# Altium project egse.PrjPcb (part 3 of 5)

## Sheet 4_mcu.SchDoc: Microcontroller
size A4; OrganizationName: Pluton UPV; Address1: Universitat Politècnica; Address2: de València (UPV); Address3: Camí de Vera, València; Address4: Spain; SheetNumber: 5; SheetTotal: 12
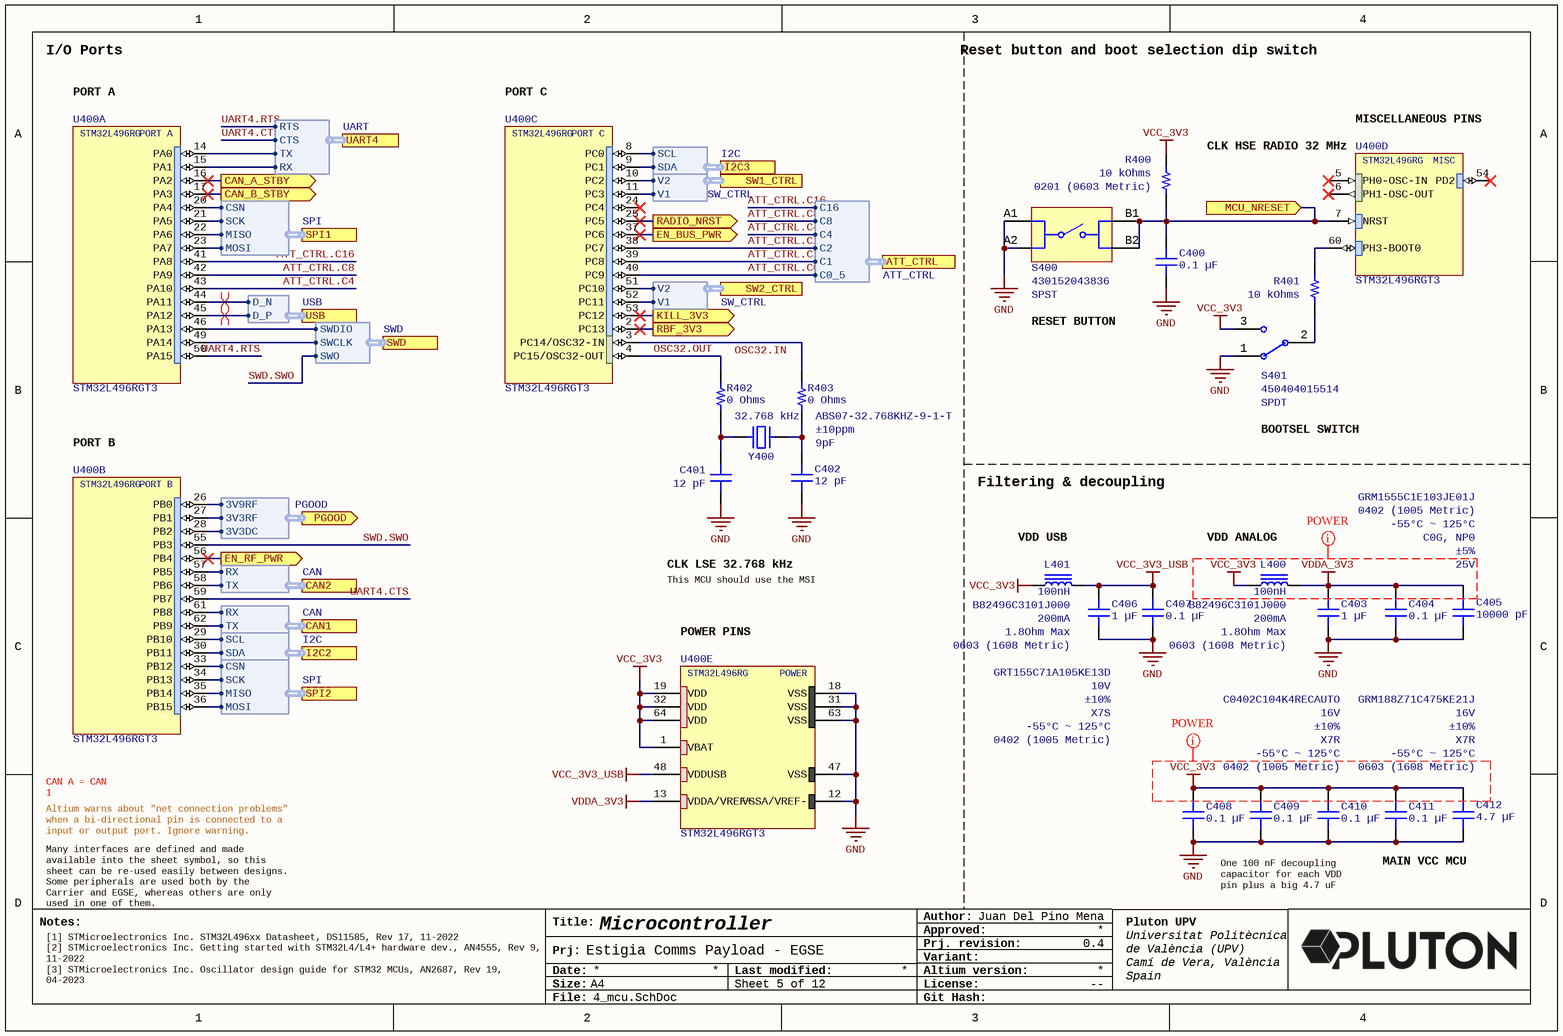
[diagram p4: 4_mcu.SchDoc]

### Parts
C400  0.1 µF  [CAP 0402_1005]
C401  12 pF  [CAP 0201_0603]
C402  12 pF  [CAP 0201_0603]
C403  1 µF  [CAP 0402_1005]
C404  0.1 µF  [CAP 0402_1005]
C405  Part Number: GRM1555C1E103JE01J  Device Package: 0402 (1005 Metric)  Operating Temperature: -55°C ~ 125°C  Temperature Coefficient: C0G, NP0  Tolerance: ±5%  Voltage - Rated: 25V  [CAP 0402_1005]  (hidden comment: 10000 pF)
C406  Part Number: GRT155C71A105KE13D  Device Package: 0402 (1005 Metric)  Operating Temperature: -55°C ~ 125°C  Temperature Coefficient: X7S  Tolerance: ±10%  Voltage - Rated: 10V  [CAP 0402_1005]  (hidden comment: 1 µF)
C407  0.1 µF  [CAP 0402_1005]
C408  0.1 µF  [CAP 0402_1005]
C409  Part Number: C0402C104K4RECAUTO  Operating Temperature: -55°C ~ 125°C  Package / Case: 0402 (1005 Metric)  Temperature Coefficient: X7R  Tolerance: ±10%  Voltage - Rated: 16V  [CAP 0402_1005]  (hidden comment: 0.1 µF)
C410  0.1 µF  [CAP 0402_1005]
C411  0.1 µF  [CAP 0402_1005]
C412  Part Number: GRM188Z71C475KE21J  Device Package: 0603 (1608 Metric)  Operating Temperature: -55°C ~ 125°C  Temperature Coefficient: X7R  Tolerance: ±10%  Voltage - Rated: 16V  [CAP 0603_1608]  (hidden comment: 4.7 µF)
L400  100nH  Part Number: B82496C3101J000  Current Rating (Amps): 200mA  DC Resistance (DCR): 1.8Ohm Max  Device Package: 0603 (1608 Metric)  [IND 0603_1608 RF WW]
L401  100nH  Part Number: B82496C3101J000  Current Rating (Amps): 200mA  DC Resistance (DCR): 1.8Ohm Max  Device Package: 0603 (1608 Metric)  [IND 0603_1608 RF WW]
R400  Package / Case: 0201 (0603 Metric)  [RES 0201_0603]  (hidden comment: 10 kOhms)
R401  10 kOhms  [RES 0201_0603]
R402  0 Ohms  [RES 0201_0603]
R403  0 Ohms  [RES 0201_0603]
S400  430152043836  Throw Configuration: SPST  [WS-TASV_L6W6H4.3_4301x20438x6]
S401  Circuit: SPDT  [WURTH WS-SLSU 450404015514]  (hidden comment: 450404015514)
U400  STM32L496RGT3  [LQFP64]  (parts A,B,C,D,E of 5)
Y400  Part Number: ABS07-32.768KHZ-9-1-T  Frequency Tolerance: ±10ppm  Load Capacitance: 9pF  [ABRACON ABS07]  (hidden comment: 32.768 kHz)

### Ports
ATT_CTRL (harness ATT_CTRL, see 1_cover[3B], 5_1_attenuators[4B], 5_rf_path[2C]), CAN1 (harness CAN, see 1_cover[3A]), CAN2 (harness CAN, see 1_cover[3B]), CAN_A_STBY (out, see 1_cover[3A], 2_cubesat_bus[3A]), CAN_B_STBY (out, see 1_cover[3B], 2_cubesat_bus[3B]), EN_BUS_PWR (out, see 1_cover[3C], 7_power_prot_mon[1C]), EN_RF_PWR (out, see 1_cover[3B], 6_power_dcdc[1B]), I2C2 (harness I2C, see 1_cover[3B]), I2C3 (harness I2C, see 1_cover[3C]), KILL_3V3 (out, see 1_cover[3B], 2_cubesat_bus[4C]), MCU_NRESET (in, see 1_cover[3C], 3_ports[3A]), PGOOD (out, harness PGOOD, see 1_cover[3B], 6_power_dcdc[4A]), RADIO_NRST (out, see 1_cover[3B], 5_4_transceiver[1B], 5_rf_path[1B]), RBF_3V3 (out, see 1_cover[3B], 2_cubesat_bus[4C]), SPI1 (harness SPI, see 1_cover[3B]), SPI2 (harness SPI, see 1_cover[3B]), SW1_CTRL (harness SW_CTRL, see 1_cover[3B], 5_rf_path[1A]), SW2_CTRL (harness SW_CTRL, see 1_cover[3B], 5_rf_path[1A]), SWD (harness SWD, see 1_cover[3C], 3_ports[3A]), UART4 (harness UART, see 1_cover[3C]), USB (harness USB, see 1_cover[3C], 3_ports[3C])

### Harnesses
SPI: CSN, SCK, MISO, MOSI
CAN: RX, TX
I2C: SCL, SDA
SWD: SWDIO, SWCLK, SWO
USB: D_N, D_P
UART: TX, RX, CTS, RTS
PGOOD: 3V3DC, 3V3RF, 3V9RF
ATT_CTRL: C16, C8, C4, C2, C1, C0_5
SW_CTRL: V1, V2

### Nets
GND: C400.1 C401.1 C402.1 C403.1 C404.1 C405.1 C406.1 C407.1 C408.1 C409.1 C410.1 C411.1 C412.1 S400.A1 S400.A2 S401.1 U400.12(VSSA/VREF-) U400.18(VSS) U400.31(VSS) U400.47(VSS) U400.63(VSS)
VCC_3V3: C408.2 C409.2 C410.2 C411.2 C412.2 L400.1 L401.1 R400.2 S401.3 U400.1(VBAT) U400.19(VDD) U400.32(VDD) U400.64(VDD)
VCC_3V3_USB: C406.2 C407.2 L401.2 U400.48(VDDUSB)
VDDA_3V3: C403.2 C404.2 C405.2 L400.2 U400.13(VDDA/VREF+)
ATT_CTRL.C0_5: U400.40(PC9) ; port ATT_CTRL.C0_5
ATT_CTRL.C1: U400.39(PC8) ; port ATT_CTRL.C1
ATT_CTRL.C2: U400.38(PC7) ; port ATT_CTRL.C2
ATT_CTRL.C4: U400.43(PA10) ; port ATT_CTRL.C4
ATT_CTRL.C8: U400.42(PA9) ; port ATT_CTRL.C8
ATT_CTRL.C16: U400.41(PA8) ; port ATT_CTRL.C16
CAN_A_STBY: U400.16(PA2) ; port CAN_A_STBY
CAN_B_STBY: U400.17(PA3) ; port CAN_B_STBY
EN_BUS_PWR: U400.37(PC6) ; port EN_BUS_PWR
EN_RF_PWR: U400.56(PB4) ; port EN_RF_PWR
KILL_3V3: U400.53(PC12) ; port KILL_3V3
MCU_NRESET: C400.2 R400.1 S400.B1 S400.B2 U400.7(NRST) ; port MCU_NRESET
OSC32.IN: R403.2 U400.3(PC14/OSC32-IN)  [project net OSC32.IN_5]
OSC32.OUT: R402.2 U400.4(PC15/OSC32-OUT)  [project net OSC32.OUT_5]
PGOOD.3V3DC: U400.28(PB2) ; port PGOOD.3V3DC
PGOOD.3V3RF: U400.27(PB1) ; port PGOOD.3V3RF
PGOOD.3V9RF: U400.26(PB0) ; port PGOOD.3V9RF
RADIO_NRST: U400.25(PC5) ; port RADIO_NRST
RBF_3V3: U400.2(PC13) ; port RBF_3V3
SWD.SWO: U400.55(PB3) ; port SWD.SWO
UART4.CTS: U400.59(PB7) ; port UART4.CTS
UART4.RTS: U400.50(PA15) ; port UART4.RTS
NetC401_2: C401.2 R402.1 Y400.1
NetC402_2: C402.2 R403.1 Y400.2
NetC548_2: U400.20(PA4) ; port SPI1.CSN
NetR401_1: R401.1 S401.2(COM)
NetR401_2: R401.2 U400.60(PH3-BOOT0)
NetR500_1: U400.11(PC3) ; port SW1_CTRL.V1
NetR500_2: U400.10(PC2) ; port SW1_CTRL.V2
NetR500_3: U400.52(PC11) ; port SW2_CTRL.V1
NetR500_4: U400.51(PC10) ; port SW2_CTRL.V2
NetR700_1: U400.8(PC0) ; port I2C3.SCL
NetR701_1: U400.9(PC1) ; port I2C3.SDA
NetR800_7: U400.49(PA14) ; port SWD.SWCLK
NetR800_8: U400.46(PA13) ; port SWD.SWDIO
NetR801_7: U400.14(PA0) ; port UART4.TX
NetR801_8: U400.15(PA1) ; port UART4.RX
NetU200_1: U400.62(PB9) ; port CAN1.TX
NetU200_4: U400.61(PB8) ; port CAN1.RX
NetU201_1: U400.58(PB6) ; port CAN2.TX
NetU201_4: U400.57(PB5) ; port CAN2.RX
NetU400_21: U400.21(PA5) ; port SPI1.SCK
NetU400_22: U400.22(PA6) ; port SPI1.MISO
NetU400_23: U400.23(PA7) ; port SPI1.MOSI
NetU400_29: U400.29(PB10) ; port I2C2.SCL
NetU400_30: U400.30(PB11) ; port I2C2.SDA
NetU400_33: U400.33(PB12) ; port SPI2.CSN
NetU400_34: U400.34(PB13) ; port SPI2.SCK
NetU400_35: U400.35(PB14) ; port SPI2.MISO
NetU400_36: U400.36(PB15) ; port SPI2.MOSI
NetU400_44: U400.44(PA11) ; port USB.D_N
NetU400_45: U400.45(PA12) ; port USB.D_P

Not connected (* = marked no-connect by the designer): U400 5(PH0-OSC-IN)* 6(PH1-OSC-OUT)* 24(PC4)* 54(PD2)*

### Layout directives
differential pair: NetU400_44, NetU400_45
rule Width Constraint [Pref Width = 0.4mm    Min Width = 0.3mm    Max Width = 0.5mm]; net class POWER: VCC_3V3, VDDA_3V3

### Notes on the sheet
- I/O Ports
- PORT A
- PORT C
- Reset button and boot selection dip switch
- CLK HSE RADIO 32 MHz
- MISCELLANEOUS PINS
- RESET BUTTON
- PORT B
- BOOTSEL SWITCH
- Filtering & decoupling
- CLK LSE 32.768 kHz
- This MCU should use the MSI clock
- (near L401) VDD USB
- (near L400) VDD ANALOG
- POWER PINS
- CAN A = CAN 1
  CAN B = CAN 2
- Altium warns about "net connection problems" when a bi-directional pin is connected to a input or output port. Ignore warning.
- Many interfaces are defined and made available into the sheet symbol, so this sheet can be re-used easily between designs. Some peripherals are used both by the Carrier and EGSE, whereas others are only used in one of them.
- One 100 nF decoupling capacitor for each VDD pin plus a big 4.7 uF cap [2]
- MAIN VCC MCU
- [1] STMicroelectronics Inc. STM32L496xx Datasheet, DS11585, Rev 17, 11-2022
  [2] STMicroelectronics Inc. Getting started with STM32L4/L4+ hardware dev., AN4555, Rev 9, 11-2022
  [3] STMicroelectronics Inc. Oscillator design guide for STM32 MCUs, AN2687, Rev 19, 04-2023
- Notes:
- Title:
- Author:
- Approved:
- Date:
- Prj:
- Size:
- A4
- Last modified:
- Altium version:
- Variant:
- Prj. revision:
- License:
- --
- File:
- Git Hash:
- (in symbol STM32L496RGT3, part A) STM32L496RG; PORT A
- (in symbol STM32L496RGT3, part B) STM32L496RG; PORT B
- (in symbol STM32L496RGT3, part C) STM32L496RG; PORT C
- (in symbol STM32L496RGT3, part D) STM32L496RG; MISC
- (in symbol STM32L496RGT3, part E) STM32L496RG; POWER

### Library data of the parts
C400 C404 C407-C411 = C0402C104K4RECAUTO: CAP CER 0402 0.1UF 16V X7R 10%; manufacturer: KEMET; Value: 0.1 µF; Applications: Automotive, ESD Protection; Capacitance: 0.1 µF; componentlink1description: Datasheet; componentlink1url: https://api.kemet.com/component-edge/download/datasheet/C0402C104K4RECAUTO.pdf; componentlink2description: DigiKey Link; componentlink2url: https://www.digikey.com/en/products/detail/kemet/C0402C104K4RECAUTO/8563695; Device Package: 0402 (1005 Metric); lastupdated: 09/02/2024 20:04:38; Lifecycle Status: Active; Minimum Order: 1; Mounting Type: Surface Mount, MLCC; packaging: TapeAndReel; partid: 1731; Part Status: Active; price: 0.01; Ratings: AEC-Q200; series: ESD SMD Auto X7R; Size / Dimension: 0.039" L x 0.020" W (1.00mm x 0.50mm); Supplier 1: DigiKey; Supplier Part Number 1: 399-17167-1-ND; Thickness (Max): 0.022" (0.55mm)
  C400 C404 C407 C408 C410 C411: Part Number: C0402C104K4RECAUTO; Operating Temperature: -55°C ~ 125°C; Package / Case: 0402 (1005 Metric); Temperature Coefficient: X7R; Tolerance: ±10%; Voltage - Rated: 16V
C401 C402 = CBR02C120F3GAC: CAP CER 12PF 25V C0G/NP0 0201; manufacturer: KEMET; Temperature Coefficient: C0G, NP0; Tolerance: ±1%; Part Number: CBR02C120F3GAC; Value: 12 pF; Applications: RF, Microwave, High Frequency; Capacitance: 12 pF; componentlink1description: Datasheet; componentlink1url: https://api.kemet.com/component-edge/download/datasheet/CBR02C120F3GAC.pdf; componentlink2description: DigiKey Link; componentlink2url: https://www.digikey.com/en/products/detail/kemet/CBR02C120F3GAC/3479199; Device Package: 0201 (0603 Metric); Features: High Q, Low Loss, Ultra Low ESR; lastupdated: 04/06/2024 19:01:11; Lifecycle Status: Active; Minimum Order: 1; Mounting Type: Surface Mount, MLCC; Operating Temperature: -55°C ~ 125°C; Package / Case: 0201 (0603 Metric); packaging: TapeAndReel; partid: 143; Part Status: Active; price: 0.07; series: CBR-SMD RF C0G; Size / Dimension: 0.024" L x 0.012" W (0.60mm x 0.30mm); Supplier 1: DigiKey; Supplier Part Number 1: 399-8604-1-ND; Thickness (Max): 0.013" (0.33mm); Voltage - Rated: 25V
C403 = GRT155C71A105KE13D: CAP CER 1UF 10V X7S 0402; manufacturer: Murata Electronics; Tolerance: ±10%; Part Number: GRT155C71A105KE13D; Value: 1 µF; Applications: Automotive; Capacitance: 1 µF; componentlink1description: Datasheet; componentlink1url: https://search.murata.co.jp/Ceramy/image/img/A01X/G101/ENG/GRT155C71A105KE13-01.pdf; componentlink2description: DigiKey Link; componentlink2url: https://www.digikey.com/en/products/detail/murata-electronics/GRT155C71A105KE13D/10695747; Device Package: 0402 (1005 Metric); lastupdated: 09/02/2024 20:04:05; Lifecycle Status: Active; Minimum Order: 1; Mounting Type: Surface Mount, MLCC; Operating Temperature: -55°C ~ 125°C; Package / Case: 0402 (1005 Metric); packaging: TapeAndReel; partid: 47127; Part Status: Active; price: 0.04; Ratings: AEC-Q200; series: GRT; Size / Dimension: 0.039" L x 0.020" W (1.00mm x 0.50mm); Supplier 1: DigiKey; Supplier Part Number 1: 490-GRT155C71A105KE13DCT-ND; Temperature Coefficient: X7S; Thickness (Max): 0.024" (0.60mm); Voltage - Rated: 10V
C405 = GRM1555C1E103JE01J: CAP CER 10000PF 25V C0G/NP0 0402; manufacturer: Murata Electronics; Value: 10000 pF; Applications: General Purpose; Capacitance: 10000 pF; componentlink1description: Datasheet; componentlink1url: https://search.murata.co.jp/Ceramy/image/img/A01X/G101/ENG/GRM1555C1E103JE01-01A.pdf; componentlink2description: DigiKey Link; componentlink2url: https://www.digikey.com/en/products/detail/murata-electronics/GRM1555C1E103JE01J/16033801; lastupdated: 09/02/2024 20:04:09; Lifecycle Status: Active; Minimum Order: 1; Mounting Type: Surface Mount, MLCC; Package / Case: 0402 (1005 Metric); packaging: TapeAndReel; partid: 41084; Part Status: Active; price: 0.02; series: GRM; Size / Dimension: 0.039" L x 0.020" W (1.00mm x 0.50mm); Supplier 1: DigiKey; Supplier Part Number 1: 490-GRM1555C1E103JE01JCT-ND; Thickness (Max): 0.026" (0.65mm)
C406 = GRT155C71A105KE13D: as C204 on sheet 2_cubesat_bus; Value: 1 µF; Applications: Automotive; Capacitance: 1 µF; componentlink1description: Datasheet; componentlink1url: https://search.murata.co.jp/Ceramy/image/img/A01X/G101/ENG/GRT155C71A105KE13-01.pdf; componentlink2description: DigiKey Link; componentlink2url: https://www.digikey.com/en/products/detail/murata-electronics/GRT155C71A105KE13D/10695747; lastupdated: 09/02/2024 20:04:05; Lifecycle Status: Active; Minimum Order: 1; Mounting Type: Surface Mount, MLCC; Package / Case: 0402 (1005 Metric); packaging: TapeAndReel; partid: 47127; Part Status: Active; price: 0.04; Ratings: AEC-Q200; series: GRT; Size / Dimension: 0.039" L x 0.020" W (1.00mm x 0.50mm); Supplier 1: DigiKey; Supplier Part Number 1: 490-GRT155C71A105KE13DCT-ND; Thickness (Max): 0.024" (0.60mm)
C412 = GRM188Z71C475KE21J: CAP CER 4.7UF 16V X7R 0603; manufacturer: Murata Electronics; Value: 4.7 µF; Applications: General Purpose; Capacitance: 4.7 µF; componentlink1description: Datasheet; componentlink1url: https://search.murata.co.jp/Ceramy/image/img/A01X/G101/ENG/GRM188Z71C475KE21-01A.pdf; componentlink2description: DigiKey Link; componentlink2url: https://www.digikey.com/en/products/detail/murata-electronics/GRM188Z71C475KE21J/16033436; lastupdated: 09/02/2024 20:09:51; Lifecycle Status: Active; Minimum Order: 1; Mounting Type: Surface Mount, MLCC; Package / Case: 0603 (1608 Metric); packaging: TapeAndReel; partid: 41988; Part Status: Active; price: 0.04; series: GRM; Size / Dimension: 0.063" L x 0.031" W (1.60mm x 0.80mm); Supplier 1: DigiKey; Supplier Part Number 1: 490-GRM188Z71C475KE21JCT-ND; Thickness (Max): 0.039" (1.00mm)
L400 L401 = B82496C3101J000: FIXED IND 100NH 200MA 1.8 OHM; Manufacturer: TDK Electronics Inc.; Frequency - Self Resonant: 1.8GHz; Inductance Frequency - Test: 100MHz; Material - Core: Ceramic; Q @ Freq: 14 @ 100MHz; Shielding: Unshielded; Tolerance: ±5%; Type: Wirewound; ComponentLink1Description: Datasheet; ComponentLink1URL: https://www.tdk-electronics.tdk.com/inf/30/db/ind_2008/b82496c.pdf; ComponentLink2Description: DigiKey Link; ComponentLink2URL: http://digikey.com/product-detail/en/tdk-electronics-inc/B82496C3101J000/495-1825-1-ND/697680; Inductance: 100nH; LastUpdated: 06/09/2020 11:05:16; Lifecycle Status: Active; Minimum Order: 1; Mounting Type: Surface Mount; Operating Temperature: -55°C ~ 150°C; Package / Case: 0603 (1608 Metric); Packaging: TapeAndReel; PartId: 755; Part Status: Active; Price: 0.16; Ratings: AEC-Q200; Series: SIMID; Supplier 1: DigiKey; Supplier Part Number 1: 495-1825-1-ND; Supplier Device Package: 0603 (1608 Metric); Value: 100nH
R400 R401 = AF0201FR-0710KL: RES SMD 10K OHM 1% 1/20W 0201; Manufacturer: Yageo; Power (Watts): 0.05W, 1/20W; Temperature Coefficient: ±200ppm/°C; Part Number: AF0201FR-0710KL; Value: 10 kOhms; ComponentLink1Description: Datasheet; ComponentLink1URL: https://www.yageo.com/upload/media/product/productsearch/datasheet/rchip/PYu-AF_51_RoHS_L_9.pdf; ComponentLink2Description: DigiKey Link; ComponentLink2URL: https://www.digikey.com/en/products/detail/yageo/AF0201FR-0710KL/5900138; Composition: Thick Film; Device Package: 0201 (0603 Metric); Features: Anti-Sulfur, Automotive AEC-Q200; Height - Seated (Max): 0.010" (0.26mm); LastUpdated: 04/06/2024 19:11:47; Lifecycle Status: Active; Minimum Order: 1; Number of Terminations: 2; Operating Temperature: -55°C ~ 125°C; Packaging: TapeAndReel; PartId: 78061; Part Status: Active; Price: 0.01; Ratings: AEC-Q200; Resistance: 10 kOhms; Series: AF; Size / Dimension: 0.024" L x 0.012" W (0.60mm x 0.30mm); Supplier 1: DigiKey; Supplier Part Number 1: 13-AF0201FR-0710KLCT-ND; Supplier Device Package: 0201; Tolerance: ±1%
  R401: Package / Case: 0201 (0603 Metric)
R402 R403 = AC0201JR-070RL: RES SMD 0 OHM JUMPER 1/20W 0201; Manufacturer: Yageo; Power (Watts): 0.05W, 1/20W; Part Number: AC0201JR-070RL; Value: 0 Ohms; ComponentLink1Description: Datasheet; ComponentLink1URL: https://www.yageo.com/upload/media/product/productsearch/datasheet/rchip/PYu-AC_51_RoHS_L_7.pdf; ComponentLink2Description: DigiKey Link; ComponentLink2URL: https://www.digikey.com/en/products/detail/yageo/AC0201JR-070RL/5894880; Composition: Thick Film; Device Package: 0201 (0603 Metric); Features: Automotive AEC-Q200, Moisture Resistant; Height - Seated (Max): 0.010" (0.26mm); LastUpdated: 04/06/2024 19:12:00; Lifecycle Status: Active; Minimum Order: 1; Number of Terminations: 2; Operating Temperature: -55°C ~ 155°C; Package / Case: 0201 (0603 Metric); Packaging: CutTape; PartId: 818; Part Status: Active; Price: 0.01; Ratings: AEC-Q200; Resistance: 0 Ohms; Series: AC; Size / Dimension: 0.024" L x 0.012" W (0.60mm x 0.30mm); Supplier 1: DigiKey; Supplier Part Number 1: YAG3427CT-ND; Supplier Device Package: 0201; Tolerance: Jumper
S400 = CMP-1452-00002-2: NexarPartId: 22861785; Voltage Rating: 12V; Current Rating: 50mA; Switch Travel: 250µm; Switch Function: Off-Mom; Actuator Material: Liquid Crystal Polymer, Polymer; Insulation Resistance: 100MΩ; Actuator Length: 900µm; Mechanical Life: 200kcycles; Illumination Type: Illuminated, Non-Illuminated; Mount: Surface Mount; Max Operating Temperature: 85°C; Height: 4.3mm; RoHS: Compliant; Length: 6.2mm; Color: Orange; Width: 6.2mm; Contact Current Rating: 50mA; Diameter: 3.5mm; Termination: Gull Wing; Packaging: Tape and Reel; REACH SVHC: No SVHC; Contact Plating: Silver; Min Operating Temperature: -40°C; Contact Material: Stainless Steel, Steel
S401 = 450404015514: MINI SLIDE SWITCH 6.7 X 2.7 MM.; Manufacturer: Würth Elektronik; Rated Current: 300mA; Rated Voltage: 5VDC; Switching Function: On-On; Actuator Length: 1.50mm; Actuator Type: Standard; Contact Timing: Non-Shorting (BBM); Current Rating (Amps): 300mA (DC); Voltage Rating - DC: 5 V; ComponentLink1Description: Datasheet; ComponentLink1URL: https://katalog.we-online.de/em/datasheet/450404015514.pdf; ComponentLink2Description: DigiKey Link; ComponentLink2URL: https://www.digikey.com/en/products/detail/würth-elektronik/450404015514/9950812; Packaging: TapeAndReel; Publisher: Wurth Elektronik; Contact Material: Copper Alloy; Mounting Technology: SMT; Operating Temperature: -40°C ~ 85°C; Contact Plating: Silver; Part Number: 450404015514; Published Date: September 2019; Terminal Material: Copper Alloy; Size: 6.7x2.7mm; Terminal Plating: Silver; Contact Finish: Silver; LastUpdated: 20/06/2022 13:21:56; Lifecycle Status: Active; Minimum Order: 1; Mounting Type: Surface Mount; PartId: 5; Part Status: Active; Price: 0.48; Series: WS-SLSU; Supplier 1: DigiKey; Supplier Part Number 1: 732-13665-1-ND; Switch Function: On-On; Termination Style: SMD (SMT) Tab
U400 = STM32L496RGT3: Ultra-low-power Arm® Cortex®-M4 32-bit MCU+FPU, 100 DMIPS, up to 1 MB flash, 320 KB SRAM, USB OTG FS, audio, LQFP64
Y400 = ABS07-32.768KHZ-9-1-T: CRYSTAL 32.7680KHZ 9PF SMD; Manufacturer: Abracon LLC; ESR (Equivalent Series Resistance): 70 kOhms; Operating Mode: Fundamental; ComponentLink1Description: Datasheet; ComponentLink1URL: https://abracon.com/Resonators/ABS07.pdf; ComponentLink2Description: DigiKey Link; ComponentLink2URL: https://www.digikey.com/en/products/detail/abracon-llc/ABS07-32-768KHZ-9-1-T/5980075; Frequency: 32.768 kHz; Height - Seated (Max): 0.035" (0.90mm); LastUpdated: 03/06/2024 20:02:04; Lifecycle Status: Active; Minimum Order: 1; Mounting Type: Surface Mount; Operating Temperature: -40°C ~ 85°C; Package / Case: 2-SMD, No Lead; Packaging: TapeAndReel; PartId: 380; Part Status: Active; Price: 0.86; Series: ABS07; Size / Dimension: 0.126" L x 0.059" W (3.20mm x 1.50mm); Supplier 1: DigiKey; Supplier Part Number 1: 535-13479-1-ND; Type: kHz Crystal (Tuning Fork); Value: 32.768 kHz

## Sheet 5_rf_path.SchDoc: RF path and LoRa transceiver
size A4; OrganizationName: Pluton UPV; Address1: Universitat Politècnica; Address2: de València (UPV); Address3: Camí de Vera, València; Address4: Spain; SheetNumber: 6; SheetTotal: 12
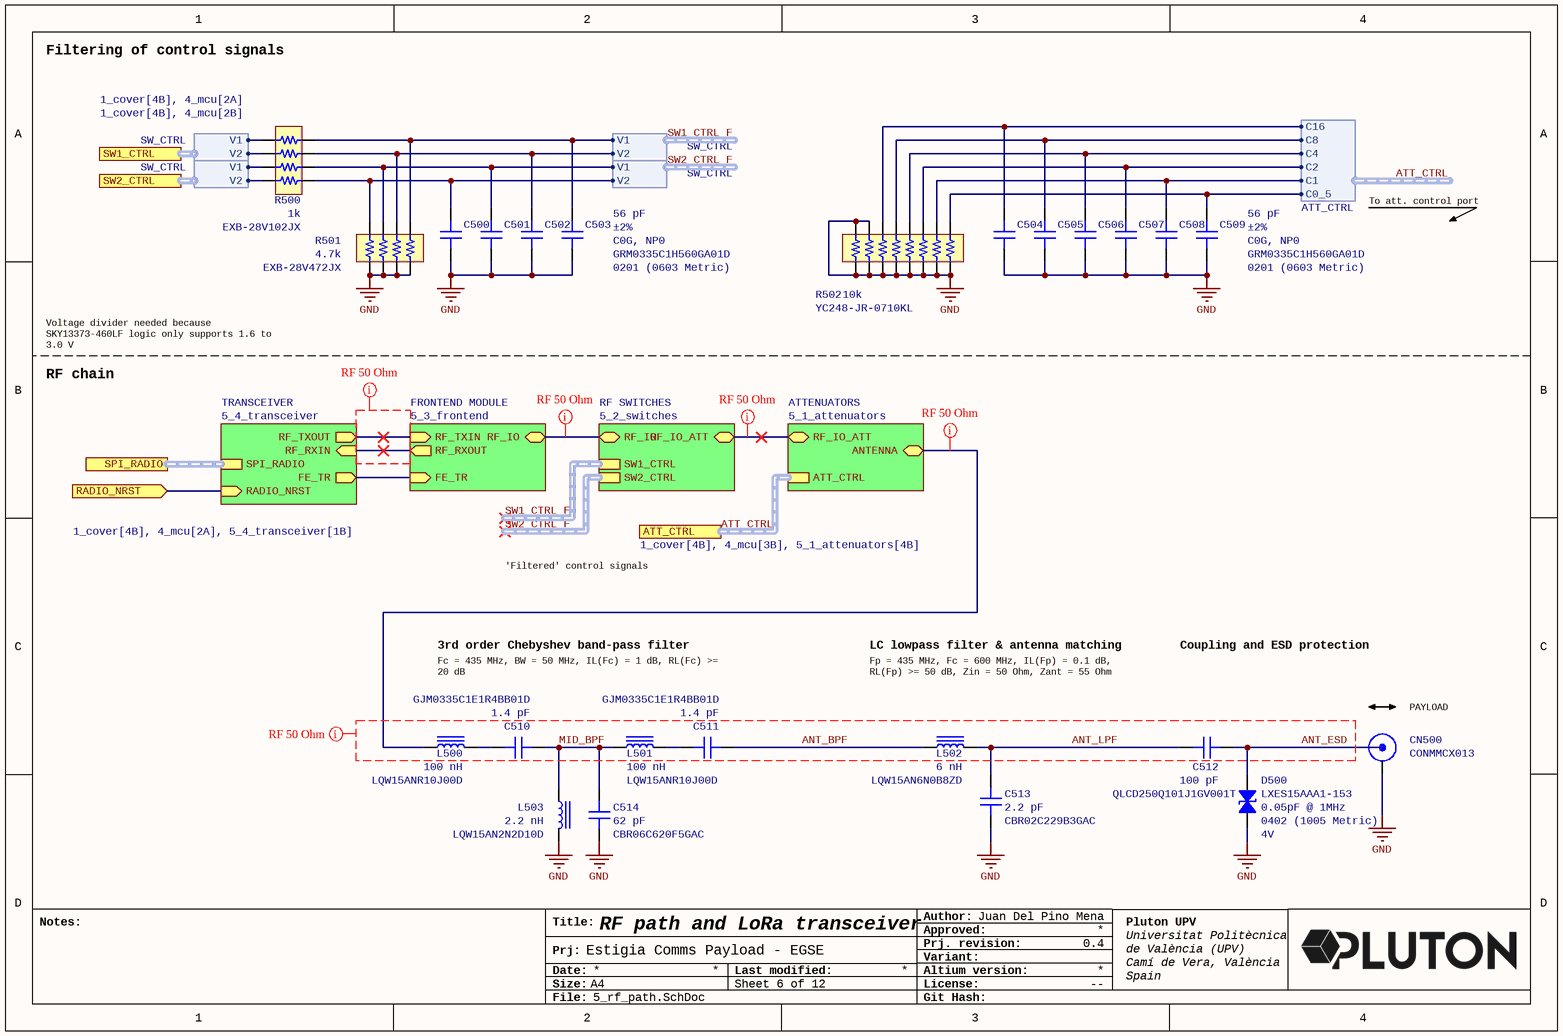
[diagram p5: 5_rf_path.SchDoc]

### Parts
C500  56 pF  [CAP 0201_0603]  (value not drawn)
C501  56 pF  [CAP 0201_0603]  (value not drawn)
C502  56 pF  [CAP 0201_0603]  (value not drawn)
C503  Part Number: GRM0335C1H560GA01D  Package / Case: 0201 (0603 Metric)  Temperature Coefficient: C0G, NP0  Tolerance: ±2%  [CAP 0201_0603]  (hidden comment: 56 pF)
C504  56 pF  [CAP 0201_0603]  (value not drawn)
C505  56 pF  [CAP 0201_0603]  (value not drawn)
C506  56 pF  [CAP 0201_0603]  (value not drawn)
C507  56 pF  [CAP 0201_0603]  (value not drawn)
C508  56 pF  [CAP 0201_0603]  (value not drawn)
C509  Part Number: GRM0335C1H560GA01D  Package / Case: 0201 (0603 Metric)  Temperature Coefficient: C0G, NP0  Tolerance: ±2%  [CAP 0201_0603]  (hidden comment: 56 pF)
C510  Part Number: GJM0335C1E1R4BB01D  [CAP 0201_0603 RF]  (hidden comment: 1.4 pF)
C511  Part Number: GJM0335C1E1R4BB01D  [CAP 0201_0603 RF]  (hidden comment: 1.4 pF)
C512  Part Number: QLCD250Q101J1GV001T  [CAP 0201_0603 RF]  (hidden comment: 100 pF)
C513  Part Number: CBR02C229B3GAC  [CAP 0201_0603 RF]  (hidden comment: 2.2 pF)
C514  Part Number: CBR06C620F5GAC  [CAP 0603_1608 RF]  (hidden comment: 62 pF)
CN500  CONMMCX013  [CONMMCX013]
D500  Capacitance @ Frequency: 0.05pF @ 1MHz  Device Package: 0402 (1005 Metric)  Voltage - Reverse Standoff (Typ): 4V  [0402]  (hidden comment: LXES15AAA1-153)
L500  Part Number: LQW15ANR10J00D  [IND 0402_1005 RF WW]  (hidden comment: 100 nH)
L501  Part Number: LQW15ANR10J00D  [IND 0402_1005 RF WW]  (hidden comment: 100 nH)
L502  Part Number: LQW15AN6N0B8ZD  [IND 0402_1005 RF WW]  (hidden comment: 6 nH)
L503  Part Number: LQW15AN2N2D10D  [IND 0402_1005 RF WW]  (hidden comment: 2.2 nH)
R500  Resistance (Ohms): 1k  [RESNET 0804-8 CONVEX]  (hidden comment: EXB-28V102JX)
R501  Resistance (Ohms): 4.7k  [RESNET 0804-8 CONVEX]  (hidden comment: EXB-28V472JX)
R502  Resistance (Ohms): 10k  [RESNET 1606-16 CONVEX]  (hidden comment: YC248-JR-0710KL)

### Sub-sheets
ATTENUATORS = 5_1_attenuators: RF_IO_ATT (bidir), ANTENNA (bidir), ATT_CTRL (harness ATT_CTRL)
FRONTEND MODULE = 5_3_frontend: RF_TXIN (in), RF_RXOUT (out), RF_IO (bidir), FE_TR (in)
RF SWITCHES = 5_2_switches: RF_IO_ATT (bidir), RF_IO (bidir), SW1_CTRL (harness SW_CTRL), SW2_CTRL (harness SW_CTRL)
TRANSCEIVER = 5_4_transceiver: RF_TXOUT (out), RF_RXIN (in), FE_TR (out), SPI_RADIO (harness SPI), RADIO_NRST (in)

### Ports
ATT_CTRL (harness ATT_CTRL, see 1_cover[4B], 4_mcu[3B], 5_1_attenuators[4B]), RADIO_NRST (in, see 1_cover[4B], 4_mcu[2A], 5_4_transceiver[1B]), SPI_RADIO (harness SPI, see 1_cover[4B], 5_4_transceiver[1B]), SW1_CTRL (harness SW_CTRL, see 1_cover[4B], 4_mcu[2A]), SW2_CTRL (harness SW_CTRL, see 1_cover[4B], 4_mcu[2B])

### Harnesses
SW_CTRL: V1, V2
ATT_CTRL: C16, C8, C4, C2, C1, C0_5

### Nets
GND: C500.1 C501.1 C502.1 C503.1 C504.1 C505.1 C506.1 C507.1 C508.1 C509.1 C513.1 C514.1 CN500.2(GND) D500.1 L503.2 R501.5 R501.6 R501.7 R501.8 R502.1 R502.2 R502.3 R502.4 R502.5 R502.6 R502.7 R502.8 R502.15 R502.16
ANT_BPF: C511.2 L502.1  [project net ANT_BPF_6]
ANT_ESD: C512.2 CN500.1(SIGNAL) D500.2  [project net ANT_ESD_6]
ANT_LPF: C512.1 C513.2 L502.2  [project net ANT_LPF_6]
ANTENNA: L500.1 ; sheet ATTENUATORS/ANTENNA
ATT_CTRL.C0_5: C509.2 R502.9 ; port ATT_CTRL.C0_5
ATT_CTRL.C1: C508.2 R502.10 ; port ATT_CTRL.C1
ATT_CTRL.C2: C507.2 R502.11 ; port ATT_CTRL.C2
ATT_CTRL.C4: C506.2 R502.12 ; port ATT_CTRL.C4
ATT_CTRL.C8: C505.2 R502.13 ; port ATT_CTRL.C8
ATT_CTRL.C16: C504.2 R502.14 ; port ATT_CTRL.C16
FE_TR: sheet FRONTEND MODULE/FE_TR, sheet TRANSCEIVER/FE_TR
MID_BPF: C510.2 C514.2 L501.1 L503.1  [project net MID_BPF_6]
RADIO_NRST: port RADIO_NRST, sheet TRANSCEIVER/RADIO_NRST
RF_IO: sheet RF SWITCHES/RF_IO, sheet FRONTEND MODULE/RF_IO
RF_IO_ATT: sheet RF SWITCHES/RF_IO_ATT, sheet ATTENUATORS/RF_IO_ATT
RF_RXIN: sheet FRONTEND MODULE/RF_RXOUT, sheet TRANSCEIVER/RF_RXIN
RF_TXIN: sheet FRONTEND MODULE/RF_TXIN, sheet TRANSCEIVER/RF_TXOUT
SW1_CTRL_F.V1: C503.2 R500.8 R501.1 ; sheet RF SWITCHES/SW1_CTRL.V1
SW1_CTRL_F.V2: C502.2 R500.7 R501.2 ; sheet RF SWITCHES/SW1_CTRL.V2
SW2_CTRL_F.V1: C501.2 R500.6 R501.3 ; sheet RF SWITCHES/SW2_CTRL.V1
SW2_CTRL_F.V2: C500.2 R500.5 R501.4 ; sheet RF SWITCHES/SW2_CTRL.V2
NetC510_1: C510.1 L500.2
NetC511_1: C511.1 L501.2
NetR500_1: R500.1 ; port SW1_CTRL.V1
NetR500_2: R500.2 ; port SW1_CTRL.V2
NetR500_3: R500.3 ; port SW2_CTRL.V1
NetR500_4: R500.4 ; port SW2_CTRL.V2

### Buses and harness runs
harness ATT_CTRL = port ATT_CTRL = sheet ATTENUATORS/ATT_CTRL
harness port SPI_RADIO = sheet TRANSCEIVER/SPI_RADIO
harness SW1_CTRL_F = sheet RF SWITCHES/SW1_CTRL
harness SW2_CTRL_F = sheet RF SWITCHES/SW2_CTRL

### Layout directives
net class RF50; rule Width Constraint [Pref Impedance = 50.00ohms    Min Impedance = 50.00ohms    Max Impedance = 50.00ohms]: (no net found under the mark), ANT_BPF, ANT_ESD, ANT_LPF, ANTENNA, MID_BPF, RF_IO, RF_IO_ATT

### Notes on the sheet
- Filtering of control signals
- To att. control port
- Voltage divider needed because SKY13373-460LF logic only supports 1.6 to 3.0 V
- RF chain
- 'Filtered' control signals
- 3rd order Chebyshev band-pass filter
- LC lowpass filter & antenna matching
- Coupling and ESD protection
- Fc = 435 MHz, BW = 50 MHz, IL(Fc) = 1 dB, RL(Fc) >= 20 dB
  Za = Zb = 50 Ohm
- Fp = 435 MHz, Fc = 600 MHz, IL(Fp) = 0.1 dB,
  RL(Fp) >= 50 dB, Zin = 50 Ohm, Zant = 55 Ohm
- (near CN500) PAYLOAD
- Notes:
- Title:
- Author:
- Approved:
- Date:
- Prj:
- Size:
- A4
- Last modified:
- Altium version:
- Variant:
- Prj. revision:
- License:
- --
- File:
- Git Hash:

### Library data of the parts
C500-C502 C504-C508 = GRM0335C1H560GA01D: CAP CER 56PF 50V C0G/NP0 0201; manufacturer: Murata Electronics; Temperature Coefficient: C0G, NP0; Tolerance: ±2%; Part Number: GRM0335C1H560GA01D; Value: 56 pF; Applications: General Purpose; Capacitance: 56 pF; componentlink1description: Datasheet; componentlink1url: https://search.murata.co.jp/Ceramy/image/img/A01X/G101/ENG/GRM0335C1H560GA01-01.pdf; componentlink2description: DigiKey Link; componentlink2url: https://www.digikey.com/en/products/detail/murata-electronics/GRM0335C1H560GA01D/4358755; Device Package: 0201 (0603 Metric); lastupdated: 04/06/2024 19:01:09; Lifecycle Status: Active; Minimum Order: 1; Mounting Type: Surface Mount; Operating Temperature: -55°C ~ 125°C; Package / Case: 0201 (0603 Metric); packaging: CutTape; partid: 528; Part Status: Active; price: 0.01; series: GRM; Size / Dimension: 0.024" L x 0.012" W (0.60mm x 0.30mm); Supplier 1: DigiKey; Supplier Part Number 1: 490-13329-1-ND; Thickness (Max): 0.013" (0.33mm); Voltage - Rated: 50V
C503 C509 = GRM0335C1H560GA01D: CAP CER 56PF 50V C0G/NP0 0201; manufacturer: Murata Electronics; Value: 56 pF; Applications: General Purpose; Capacitance: 56 pF; componentlink1description: Datasheet; componentlink1url: https://search.murata.co.jp/Ceramy/image/img/A01X/G101/ENG/GRM0335C1H560GA01-01.pdf; componentlink2description: DigiKey Link; componentlink2url: https://www.digikey.com/en/products/detail/murata-electronics/GRM0335C1H560GA01D/4358755; Device Package: 0201 (0603 Metric); lastupdated: 04/06/2024 19:01:09; Lifecycle Status: Active; Minimum Order: 1; Mounting Type: Surface Mount; Operating Temperature: -55°C ~ 125°C; packaging: CutTape; partid: 528; Part Status: Active; price: 0.01; series: GRM; Size / Dimension: 0.024" L x 0.012" W (0.60mm x 0.30mm); Supplier 1: DigiKey; Supplier Part Number 1: 490-13329-1-ND; Thickness (Max): 0.013" (0.33mm); Voltage - Rated: 50V
C510 C511 = GJM0335C1E1R4BB01D: CAP CER 1.4PF 25V C0G/NP0 0201; manufacturer: Murata Electronics; Temperature Coefficient: C0G, NP0; Tolerance: ±0.1pF; Applications: RF, Microwave, High Frequency; Capacitance: 1.4 pF; componentlink1description: Datasheet; componentlink1url: https://search.murata.co.jp/Ceramy/image/img/A01X/G101/ENG/GJM0335C1E1R4BB01-01.pdf; componentlink2description: DigiKey Link; componentlink2url: https://www.digikey.com/en/products/detail/murata-electronics/GJM0335C1E1R4BB01D/2592522; Device Package: 0201 (0603 Metric); Features: High Q, Low Loss; lastupdated: 03/06/2024 19:34:09; Lifecycle Status: Active; Minimum Order: 1; Mounting Type: Surface Mount; Operating Temperature: -55°C ~ 125°C; Package / Case: 0201 (0603 Metric); packaging: TapeAndReel; partid: 255; Part Status: Active; price: 0.01; series: GJM; Size / Dimension: 0.024" L x 0.012" W (0.60mm x 0.30mm); Supplier 1: DigiKey; Supplier Part Number 1: 490-11174-1-ND; Thickness (Max): 0.013" (0.33mm); value: 1.4 pF; Voltage - Rated: 25V
C512 = QLCD250Q101J1GV001T: CAP CER 100PF 25V C0G/NP0 0201; manufacturer: Johanson Technology Inc.; Temperature Coefficient: C0G, NP0; Tolerance: ±5%; Applications: RF, Microwave, High Frequency; Capacitance: 100 pF; componentlink1description: Datasheet; componentlink1url: https://www.johansontechnology.com/downloads/catalog/johanson-technology-multi-layer-high-q-capacitors.pdf; componentlink2description: DigiKey Link; componentlink2url: https://www.digikey.com/en/products/detail/johanson-technology-inc/QLCD250Q101J1GV001T/1561511; Device Package: 0201 (0603 Metric); Features: High Q, Low Loss; lastupdated: 03/06/2024 19:34:07; Lifecycle Status: Active; Minimum Order: 1; Mounting Type: Surface Mount, MLCC; Operating Temperature: -55°C ~ 125°C; Package / Case: 0201 (0603 Metric); packaging: TapeAndReel; partid: 3724; Part Status: Active; price: 0.02; series: L; Size / Dimension: 0.024" L x 0.012" W (0.60mm x 0.30mm); Supplier 1: DigiKey; Supplier Part Number 1: 712-QLCD250Q101J1GV001TCT-ND; Thickness (Max): 0.013" (0.33mm); value: 100 pF; Voltage - Rated: 25V
C513 = CBR02C229B3GAC: CAP CER 2.2PF 25V C0G/NP0 0201; manufacturer: KEMET; Temperature Coefficient: C0G, NP0; Tolerance: ±0.1pF; Applications: RF, Microwave, High Frequency; Capacitance: 2.2 pF; componentlink1description: Datasheet; componentlink1url: https://api.kemet.com/component-edge/download/datasheet/CBR02C229B3GAC.pdf; componentlink2description: DigiKey Link; componentlink2url: https://www.digikey.com/en/products/detail/kemet/CBR02C229B3GAC/3479233; Device Package: 0201 (0603 Metric); Features: High Q, Low Loss, Ultra Low ESR; lastupdated: 03/06/2024 19:34:10; Lifecycle Status: Active; Minimum Order: 1; Mounting Type: Surface Mount, MLCC; Operating Temperature: -55°C ~ 125°C; Package / Case: 0201 (0603 Metric); packaging: TapeAndReel; partid: 161; Part Status: Active; price: 0.02; series: CBR-SMD RF C0G; Size / Dimension: 0.024" L x 0.012" W (0.60mm x 0.30mm); Supplier 1: DigiKey; Supplier Part Number 1: 399-8607-1-ND; Thickness (Max): 0.013" (0.33mm); value: 2.2 pF; Voltage - Rated: 25V
C514 = CBR06C620F5GAC: CAP CER 62PF 50V C0G/NP0 0603; manufacturer: KEMET; Temperature Coefficient: C0G, NP0; Tolerance: ±1%; Applications: RF, Microwave, High Frequency; Capacitance: 62 pF; componentlink1description: Datasheet; componentlink1url: https://api.kemet.com/component-edge/download/datasheet/CBR06C620F5GAC.pdf; componentlink2description: DigiKey Link; componentlink2url: https://www.digikey.com/en/products/detail/kemet/CBR06C620F5GAC/7649525; Device Package: 0603 (1608 Metric); Features: High Q, Low Loss, Ultra Low ESR; lastupdated: 03/06/2024 19:44:09; Lifecycle Status: Active; Minimum Order: 1; Mounting Type: Surface Mount, MLCC; Operating Temperature: -55°C ~ 125°C; Package / Case: 0603 (1608 Metric); packaging: TapeAndReel; partid: 3653; Part Status: Active; price: 0.30; series: CBR-SMD RF C0G; Size / Dimension: 0.063" L x 0.031" W (1.60mm x 0.80mm); Supplier 1: DigiKey; Supplier Part Number 1: 399-16219-1-ND; Thickness (Max): 0.035" (0.90mm); value: 62 pF; Voltage - Rated: 50V
CN500 = MMCX-CONMMCX013: MMCX Jack PCB Cutout Edge Mount Connector 0 to 8.5 GHz operation MMCX (female socket) connection
D500 = LXES15AAA1-153: TVS DIODE 4V 1005; Manufacturer: Murata Electronics; Bidirectional Channels: 1; Power Line Protection: No; Type: Zener; Part Number: LXES15AAA1-153; Applications: General Purpose; ComponentLink1Description: Datasheet; ComponentLink1URL: https://www.murata.com/en-us/products/productdata/8796832759838/CRESD-E.pdf; ComponentLink2Description: DigiKey Link; ComponentLink2URL: http://digikey.com/product-detail/en/murata-electronics/LXES15AAA1-153/490-13210-2-ND/5843762; LastUpdated: 03/06/2024 20:23:00; Lifecycle Status: Active; Minimum Order: 0; Mounting Type: Surface Mount; Operating Temperature: -40°C ~ 85°C (TA); Package / Case: 0402 (1005 Metric); Packaging: TapeAndReel; PartId: 10448; Part Status: Active; Price: 0.04; Series: -; Supplier 1: DigiKey; Supplier Part Number 1: 490-13210-2-ND; Supplier Device Package: 1005
L500 L501 = LQW15ANR10J00D: FIXED IND 100NH 120MA 2.52OHM SM; Manufacturer: Murata Electronics; DC Resistance (DCR): 2.52Ohm Max; Frequency - Self Resonant: 1.5GHz; Inductance Frequency - Test: 100 MHz; Material - Core: Non-Magnetic; Q @ Freq: 20 @ 150MHz; Shielding: Unshielded; Tolerance: ±5%; Type: Drum Core, Wirewound; ComponentLink1Description: Datasheet; ComponentLink1URL: https://search.murata.co.jp/Ceramy/image/img/P02/JELF243A-0050.pdf; ComponentLink2Description: DigiKey Link; ComponentLink2URL: https://www.digikey.com/en/products/detail/murata-electronics/LQW15ANR10J00D/1016249; Current Rating (Amps): 120 mA; Device Package: 0402 (1005 Metric); Height - Seated (Max): 0.024" (0.60mm); Inductance: 100 nH; LastUpdated: 03/06/2024 20:03:22; Lifecycle Status: Active; Minimum Order: 1; Mounting Type: Surface Mount; Operating Temperature: -55°C ~ 125°C; Package / Case: 0402 (1005 Metric); Packaging: TapeAndReel; PartId: 282; Part Status: Active; Price: 0.04; Series: LQW15; Size / Dimension: 0.039" L x 0.020" W (1.00mm x 0.50mm); Supplier 1: DigiKey; Supplier Part Number 1: 490-4090-1-ND; Value: 100 nH
L502 = LQW15AN6N0B8ZD: FIXED IND 6NH 1.6A 0.056OHM SMD; Manufacturer: Murata Electronics; DC Resistance (DCR): 56mOhm Max; Frequency - Self Resonant: 8GHz; Inductance Frequency - Test: 100 MHz; Material - Core: Non-Magnetic; Q @ Freq: 32 @ 250MHz; Shielding: Unshielded; Tolerance: ±0.1nH; Type: Drum Core, Wirewound; ComponentLink1Description: Datasheet; ComponentLink1URL: https://search.murata.co.jp/Ceramy/image/img/P02/JELF243A-9138.pdf; ComponentLink2Description: DigiKey Link; ComponentLink2URL: https://www.digikey.com/en/products/detail/murata-electronics/LQW15AN6N0B8ZD/6798964; Current Rating (Amps): 1.6 A; Device Package: 0402 (1005 Metric); Height - Seated (Max): 0.024" (0.60mm); Inductance: 6 nH; LastUpdated: 03/06/2024 20:03:25; Lifecycle Status: Active; Minimum Order: 1; Mounting Type: Surface Mount; Operating Temperature: -55°C ~ 125°C; Package / Case: 0402 (1005 Metric); Packaging: TapeAndReel; PartId: 40; Part Status: Active; Price: 0.07; Ratings: AEC-Q200; Series: LQW15; Size / Dimension: 0.039" L x 0.024" W (1.00mm x 0.60mm); Supplier 1: DigiKey; Supplier Part Number 1: 490-15539-1-ND; Value: 6 nH
L503 = LQW15AN2N2D10D: FIXED IND 2.2NH 1A 0.027OHM SMD; Manufacturer: Murata Electronics; DC Resistance (DCR): 27mOhm Max; Frequency - Self Resonant: 14GHz; Inductance Frequency - Test: 100 MHz; Material - Core: Non-Magnetic; Q @ Freq: 25 @ 250MHz; Shielding: Unshielded; Tolerance: ±0.5nH; Type: Drum Core, Wirewound; ComponentLink1Description: Datasheet; ComponentLink1URL: https://search.murata.co.jp/Ceramy/image/img/P02/JELF243A-0051.pdf; ComponentLink2Description: DigiKey Link; ComponentLink2URL: https://www.digikey.com/en/products/detail/murata-electronics/LQW15AN2N2D10D/2594881; Current Rating (Amps): 1 A; Device Package: 0402 (1005 Metric); Height - Seated (Max): 0.024" (0.60mm); Inductance: 2.2 nH; LastUpdated: 03/06/2024 20:03:23; Lifecycle Status: Active; Minimum Order: 1; Mounting Type: Surface Mount; Operating Temperature: -55°C ~ 125°C; Package / Case: 0402 (1005 Metric); Packaging: TapeAndReel; PartId: 170; Part Status: Active; Price: 0.05; Series: LQW15; Size / Dimension: 0.039" L x 0.024" W (1.00mm x 0.60mm); Supplier 1: DigiKey; Supplier Part Number 1: 490-6795-1-ND; Value: 2.2 nH
R500 = EXB-28V102JX: RES ARRAY 4 RES 1K OHM 0804; Manufacturer: Panasonic Electronic Components; Circuit Type: Isolated; Number of Resistors: 4; Power Per Element: 62.5mW; Temperature Coefficient: ±200ppm/°C; Tolerance: ±5%; Part Number: EXB-28V102JX; Applications: Automotive AEC-Q200; ComponentLink1Description: Datasheet; ComponentLink1URL: https://industrial.panasonic.com/cdbs/www-data/pdf/AOC0000/AOC0000C14.pdf; ComponentLink2Description: DigiKey Link; ComponentLink2URL: https://www.digikey.com/en/products/detail/panasonic-electronic-components/EXB-28V102JX/256287; Height - Seated (Max): 0.018" (0.45mm); LastUpdated: 03/06/2024 20:05:56; Lifecycle Status: Active; Minimum Order: 1; Mounting Type: Surface Mount; Number of Pins: 8; Operating Temperature: -55°C ~ 125°C; Package / Case: 0804, Convex, Long Side Terminals; Packaging: TapeAndReel; PartId: 492; Part Status: Active; Price: 0.01; Series: EXB; Size / Dimension: 0.079" L x 0.039" W (2.00mm x 1.00mm); Supplier 1: DigiKey; Supplier Part Number 1: Y7102CT-ND; Supplier Device Package: 0804
R501 = EXB-28V472JX: RES ARRAY 4 RES 4.7K OHM 0804; Manufacturer: Panasonic Electronic Components; Circuit Type: Isolated; Number of Resistors: 4; Power Per Element: 62.5mW; Temperature Coefficient: ±200ppm/°C; Tolerance: ±5%; Part Number: EXB-28V472JX; Applications: Automotive AEC-Q200; ComponentLink1Description: Datasheet; ComponentLink1URL: https://industrial.panasonic.com/cdbs/www-data/pdf/AOC0000/AOC0000C14.pdf; ComponentLink2Description: DigiKey Link; ComponentLink2URL: https://www.digikey.com/en/products/detail/panasonic-electronic-components/EXB-28V472JX/256295; Height - Seated (Max): 0.018" (0.45mm); LastUpdated: 03/06/2024 20:05:56; Lifecycle Status: Active; Minimum Order: 1; Mounting Type: Surface Mount; Number of Pins: 8; Operating Temperature: -55°C ~ 125°C; Package / Case: 0804, Convex, Long Side Terminals; Packaging: TapeAndReel; PartId: 462; Part Status: Active; Price: 0.01; Series: EXB; Size / Dimension: 0.079" L x 0.039" W (2.00mm x 1.00mm); Supplier 1: DigiKey; Supplier Part Number 1: Y7472CT-ND; Supplier Device Package: 0804
R502 = YC248-JR-0710KL: RES ARRAY 8 RES 10K OHM 1606; Manufacturer: Yageo; Circuit Type: Isolated; Number of Resistors: 8; Power Per Element: 62.5mW; Temperature Coefficient: ±200ppm/°C; Tolerance: ±5%; Part Number: YC248-JR-0710KL; Applications: DDRAM, SDRAM; ComponentLink1Description: Datasheet; ComponentLink1URL: https://www.yageo.com/upload/media/product/productsearch/datasheet/rchip/PYu-YC_TC_group_51_RoHS_L_9.pdf; ComponentLink2Description: DigiKey Link; ComponentLink2URL: https://www.digikey.com/en/products/detail/yageo/YC248-JR-0710KL/1005237; Height - Seated (Max): 0.022" (0.55mm); LastUpdated: 03/06/2024 20:04:14; Lifecycle Status: Active; Minimum Order: 1; Mounting Type: Surface Mount; Number of Pins: 16; Operating Temperature: -55°C ~ 155°C; Package / Case: 1606, Convex, Long Side Terminals; Packaging: TapeAndReel; PartId: 10; Part Status: Active; Price: 0.03; Series: YC248; Size / Dimension: 0.157" L x 0.063" W (4.00mm x 1.60mm); Supplier 1: DigiKey; Supplier Part Number 1: 13-YC248-JR-0710KLDKR-ND

## Sheet 5_2_switches.SchDoc: RF Switches
size A4; OrganizationName: Pluton UPV; Address1: Universitat Politècnica; Address2: de València (UPV); Address3: Camí de Vera, València; Address4: Spain; SheetNumber: 8; SheetTotal: 12
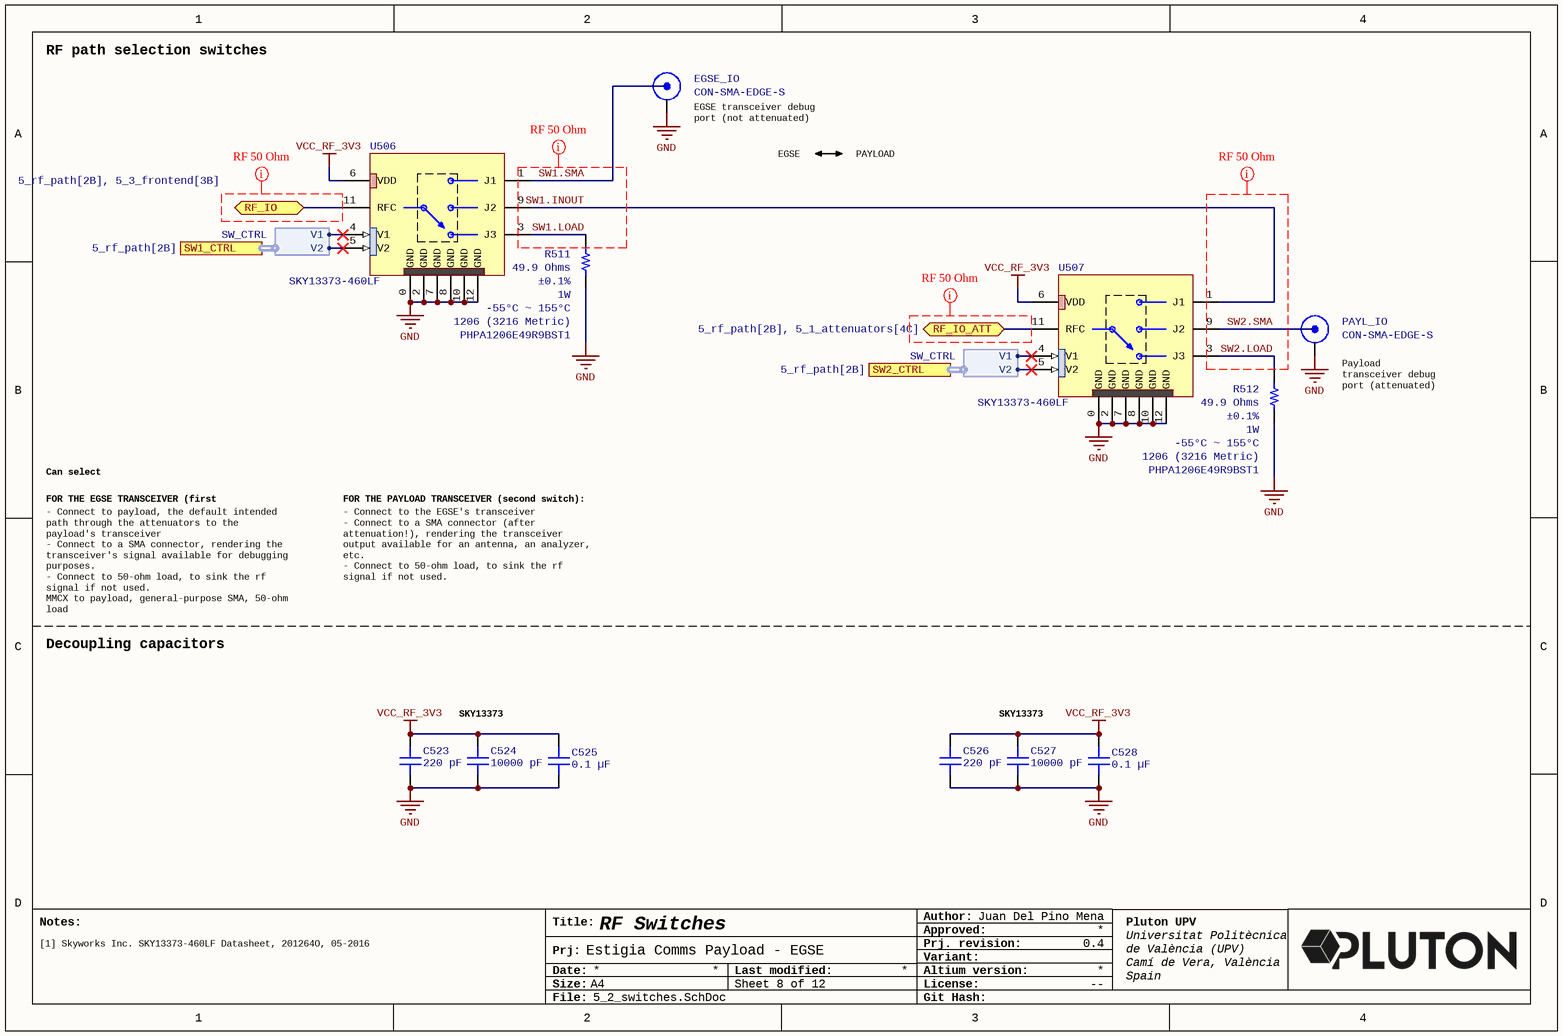
[diagram p6: 5_2_switches.SchDoc]

### Parts
C523  220 pF  [CAP 0201_0603]
C524  10000 pF  [CAP 0402_1005]
C525  0.1 µF  [CAP 0402_1005]
C526  220 pF  [CAP 0201_0603]
C527  10000 pF  [CAP 0402_1005]
C528  0.1 µF  [CAP 0402_1005]
EGSE_IO  CON-SMA-EDGE-S  [CON-SMA-EDGE-S]
PAYL_IO  CON-SMA-EDGE-S  [CON-SMA-EDGE-S]
R511  49.9 Ohms  Part Number: PHPA1206E49R9BST1  Device Package: 1206 (3216 Metric)  Operating Temperature: -55°C ~ 155°C  Power (Watts): 1W  Tolerance: ±0.1%  [RES 1206_3216]
R512  49.9 Ohms  Part Number: PHPA1206E49R9BST1  Device Package: 1206 (3216 Metric)  Operating Temperature: -55°C ~ 155°C  Power (Watts): 1W  Tolerance: ±0.1%  [RES 1206_3216]
U506  SKY13373-460LF  [SKY13373-460LF]
U507  SKY13373-460LF  [SKY13373-460LF]

### Ports
RF_IO (bidir, see 5_rf_path[2B], 5_3_frontend[3B]), RF_IO_ATT (bidir, see 5_rf_path[2B], 5_1_attenuators[4C]), SW1_CTRL (harness SW_CTRL, see 5_rf_path[2B]), SW2_CTRL (harness SW_CTRL, see 5_rf_path[2B])

### Harnesses
SW_CTRL: V1, V2

### Nets
GND: C523.1 C524.1 C525.1 C526.1 C527.1 C528.1 EGSE_IO.2(GND) PAYL_IO.2(GND) R511.1 R512.1 U506.0(GND) U506.2(GND) U506.7(GND) U506.8(GND) U506.10(GND) U506.12(GND) U507.0(GND) U507.2(GND) U507.7(GND) U507.8(GND) U507.10(GND) U507.12(GND)
VCC_RF_3V3: C523.2 C524.2 C525.2 C526.2 C527.2 C528.2 U506.6(VDD) U507.6(VDD)
RF_IO: U506.11(RFC) ; port RF_IO
RF_IO_ATT: U507.11(RFC) ; port RF_IO_ATT
SW1.INOUT: U506.9(J2) U507.1(J1)  [project net SW1.INOUT_8]
SW1.LOAD: R511.2 U506.3(J3)  [project net SW1.LOAD_8]
SW1.SMA: EGSE_IO.1(SIGNAL) U506.1(J1)  [project net SW1.SMA_8]
SW1_CTRL_F.V1: U506.4(V1) ; port SW1_CTRL.V1
SW1_CTRL_F.V2: U506.5(V2) ; port SW1_CTRL.V2
SW2.LOAD: R512.2 U507.3(J3)  [project net SW2.LOAD_8]
SW2.SMA: PAYL_IO.1(SIGNAL) U507.9(J2)  [project net SW2.SMA_8]
SW2_CTRL_F.V1: U507.4(V1) ; port SW2_CTRL.V1
SW2_CTRL_F.V2: U507.5(V2) ; port SW2_CTRL.V2

### Layout directives
net class RF50; rule Width Constraint [Pref Impedance = 50.00ohms    Min Impedance = 50.00ohms    Max Impedance = 50.00ohms]: (no net found under the mark), SW1.INOUT, SW1.LOAD, SW1.SMA, SW2.LOAD, SW2.SMA

### Notes on the sheet
- RF path selection switches
- (near EGSE_IO) EGSE transceiver debug port (not attenuated)
- EGSE
- PAYLOAD
- (near PAYL_IO) Payload transceiver debug port (attenuated)
- Can select between:
- FOR THE EGSE TRANSCEIVER (first switch):
- FOR THE PAYLOAD TRANSCEIVER (second switch):
- Decoupling capacitors
- - Connect to payload, the default intended path through the attenuators to the payload's transceiver
  - Connect to a SMA connector, rendering the transceiver's signal available for debugging purposes.
  - Connect to 50-ohm load, to sink the rf signal if not used.
  MMCX to payload, general-purpose SMA, 50-ohm load
- - Connect to the EGSE's transceiver
  - Connect to a SMA connector (after attenuation!), rendering the transceiver output available for an antenna, an analyzer, etc.
  - Connect to 50-ohm load, to sink the rf signal if not used.
- (near C524) SKY13373
- (near C527) SKY13373
- [1] Skyworks Inc. SKY13373-460LF Datasheet, 201264O, 05-2016
- Notes:
- Title:
- Author:
- Approved:
- Date:
- Prj:
- Size:
- A4
- Last modified:
- Altium version:
- Variant:
- Prj. revision:
- License:
- --
- File:
- Git Hash:

### Library data of the parts
C523 C526 = GRM0335C1H221JA01D: CAP CER 220PF 50V C0G/NP0 0201; manufacturer: Murata Electronics; Temperature Coefficient: C0G, NP0; Tolerance: ±5%; Part Number: GRM0335C1H221JA01D; Value: 220 pF; Applications: General Purpose; Capacitance: 220 pF; componentlink1description: Datasheet; componentlink1url: https://search.murata.co.jp/Ceramy/image/img/A01X/G101/ENG/GRM0335C1H221JA01-01.pdf; componentlink2description: DigiKey Link; componentlink2url: https://www.digikey.com/en/products/detail/murata-electronics/GRM0335C1H221JA01D/4904370; Device Package: 0201 (0603 Metric); lastupdated: 04/06/2024 19:01:09; Lifecycle Status: Active; Minimum Order: 1; Mounting Type: Surface Mount; Operating Temperature: -55°C ~ 125°C; Package / Case: 0201 (0603 Metric); packaging: CutTape; partid: 574; Part Status: Active; price: 0.01; series: GRM; Size / Dimension: 0.024" L x 0.012" W (0.60mm x 0.30mm); Supplier 1: DigiKey; Supplier Part Number 1: 490-11316-1-ND; Thickness (Max): 0.013" (0.33mm); Voltage - Rated: 50V
C524 C527 = GRM1555C1E103JE01J: CAP CER 10000PF 25V C0G/NP0 0402; manufacturer: Murata Electronics; Temperature Coefficient: C0G, NP0; Tolerance: ±5%; Part Number: GRM1555C1E103JE01J; Value: 10000 pF; Applications: General Purpose; Capacitance: 10000 pF; componentlink1description: Datasheet; componentlink1url: https://search.murata.co.jp/Ceramy/image/img/A01X/G101/ENG/GRM1555C1E103JE01-01A.pdf; componentlink2description: DigiKey Link; componentlink2url: https://www.digikey.com/en/products/detail/murata-electronics/GRM1555C1E103JE01J/16033801; Device Package: 0402 (1005 Metric); lastupdated: 09/02/2024 20:04:09; Lifecycle Status: Active; Minimum Order: 1; Mounting Type: Surface Mount, MLCC; Operating Temperature: -55°C ~ 125°C; Package / Case: 0402 (1005 Metric); packaging: TapeAndReel; partid: 41084; Part Status: Active; price: 0.02; series: GRM; Size / Dimension: 0.039" L x 0.020" W (1.00mm x 0.50mm); Supplier 1: DigiKey; Supplier Part Number 1: 490-GRM1555C1E103JE01JCT-ND; Thickness (Max): 0.026" (0.65mm); Voltage - Rated: 25V
C525 C528 = C0402C104K4RECAUTO: as C400 on sheet 4_mcu; Part Number: C0402C104K4RECAUTO; Value: 0.1 µF; Applications: Automotive, ESD Protection; Capacitance: 0.1 µF; componentlink1description: Datasheet; componentlink1url: https://api.kemet.com/component-edge/download/datasheet/C0402C104K4RECAUTO.pdf; componentlink2description: DigiKey Link; componentlink2url: https://www.digikey.com/en/products/detail/kemet/C0402C104K4RECAUTO/8563695; Device Package: 0402 (1005 Metric); lastupdated: 09/02/2024 20:04:38; Lifecycle Status: Active; Minimum Order: 1; Mounting Type: Surface Mount, MLCC; Operating Temperature: -55°C ~ 125°C; Package / Case: 0402 (1005 Metric); packaging: TapeAndReel; partid: 1731; Part Status: Active; price: 0.01; Ratings: AEC-Q200; series: ESD SMD Auto X7R; Size / Dimension: 0.039" L x 0.020" W (1.00mm x 0.50mm); Supplier 1: DigiKey; Supplier Part Number 1: 399-17167-1-ND; Temperature Coefficient: X7R; Thickness (Max): 0.022" (0.55mm); Tolerance: ±10%; Voltage - Rated: 16V
R511 R512 = PHPA1206E49R9BST1: THIN FILM RES SMD 49.9 OHM 0.1%; Manufacturer: Vishay Dale Thin Film; Temperature Coefficient: ±25ppm/°C; ComponentLink1Description: Datasheet; ComponentLink1URL: https://www.vishay.com/docs/60160/phpa.pdf; ComponentLink2Description: DigiKey Link; ComponentLink2URL: https://www.digikey.com/en/products/detail/vishay-dale-thin-film/PHPA1206E49R9BST1/14555186; Composition: Thin Film; Features: Anti-Sulfur, Automotive AEC-Q200, High Power, Moisture Resistant; Height - Seated (Max): 0.020" (0.51mm); LastUpdated: 09/02/2024 20:53:25; Lifecycle Status: Active; Minimum Order: 1; Number of Terminations: 2; Package / Case: 1206 (3216 Metric); Packaging: TapeAndReel; PartId: 58771; Part Status: Active; Price: 0.76; Ratings: AEC-Q200; Resistance: 49.9 Ohms; Series: PHPA; Size / Dimension: 0.126" L x 0.063" W (3.20mm x 1.60mm); Supplier 1: DigiKey; Supplier Part Number 1: 764-PHPA1206E49R9BST1CT-ND; Supplier Device Package: 1206; Value: 49.9 Ohms
U506 U507 = SKY13373-460LF: 0.1 to 8.0 GHz SP3T Switch